# Altium schematic sheet fpga.SchDoc
size A
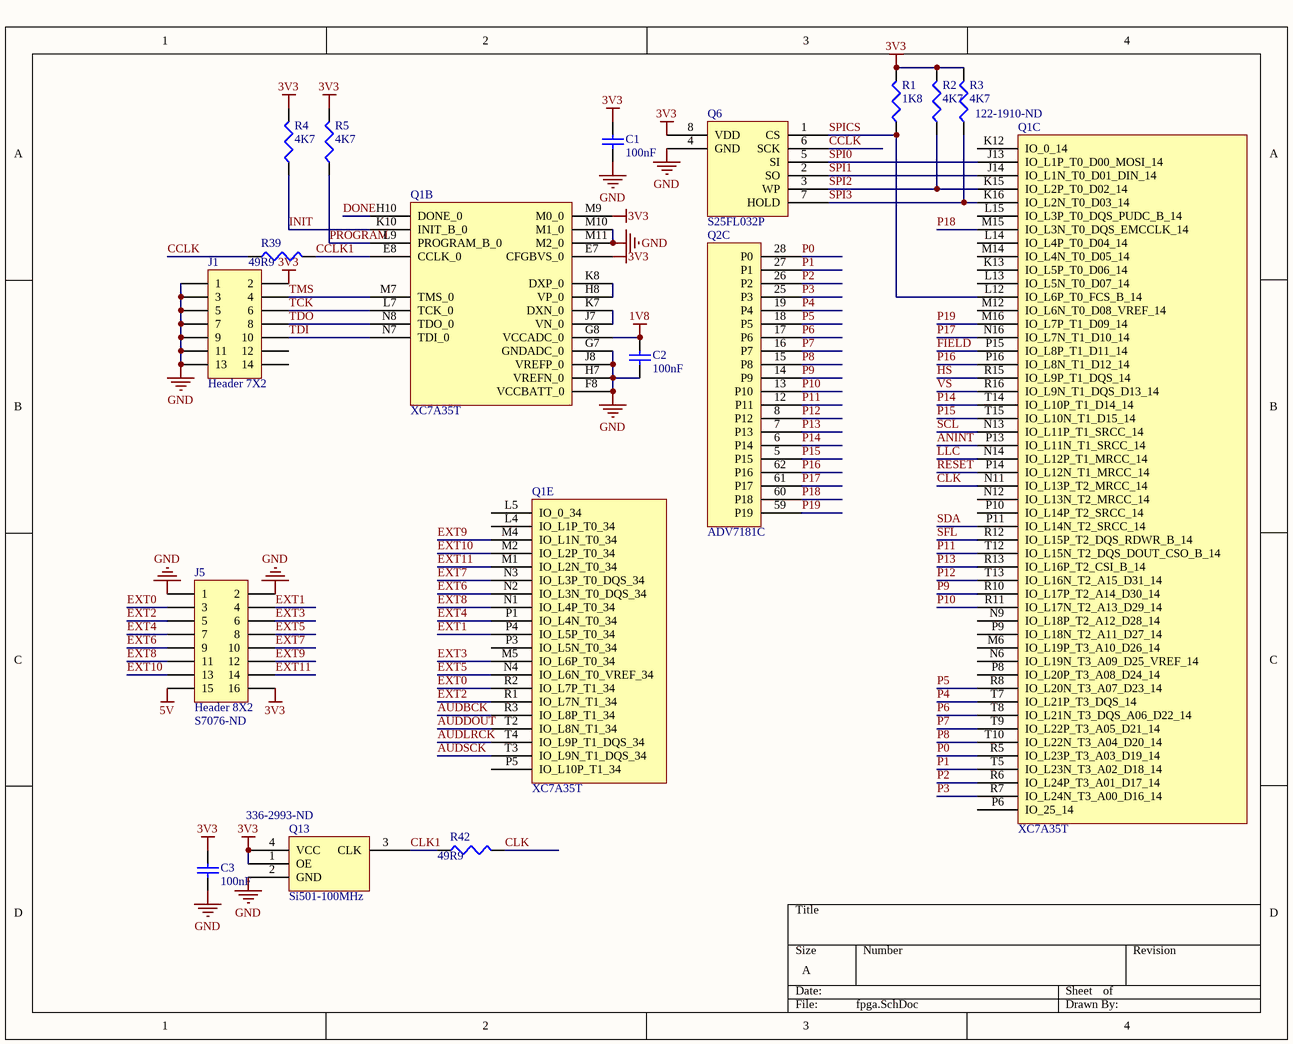
[diagram p0: fpga.SchDoc]

## Parts
C1  value 100nF  [CAPC1005X06L]  (hidden comment: Cap)
C2  value 100nF  [CAPC1005X06L]  (hidden comment: Cap)
C3  value 100nF  [CAPC1005X06L]  (hidden comment: Cap)
J1  Header 7X2  [HDR2X7]
J5  Header 8X2  Supplier Part Number 1: S7076-ND  [HDR2X8]
Q1  XC7A35T  (parts B,C,E of 6)
Q2  ADV7181C  [TSQFP50P1200X1200X145-64N]  (part C of 3)
Q6  S25FL032P  [SOIC127P600X175-8AN]
Q13  Si501-100MHz  Supplier Part Number 1: 336-2993-ND  [Si501_225]
R1  value 1K8  [CAPC1608X90N]  (hidden comment: Res3)
R2  value 4K7  [CAPC1608X90N]  (hidden comment: Res3)
R3  value 4K7  [CAPC1608X90N]  (hidden comment: Res3)
R4  value 4K7  [CAPC1608X90N]  (hidden comment: Res3)
R5  value 4K7  [CAPC1608X90N]  (hidden comment: Res3)
R39  value 49R9  [CAPC1005X06L]  (hidden comment: Res3)
R42  value 49R9  [CAPC1005X06L]  (hidden comment: Res3)

## Nets
1V8: C2.2 Q1.G8(VCCADC_0)
3V3: C1.2 C3.2 J1.2 J5.16 Q1.E7(CFGBVS_0) Q1.M9(M0_0) Q6.8(VDD) Q13.1(OE) Q13.4(VCC) R1.2 R2.2 R3.2 R4.2 R5.2
5V: J5.15
GND: C1.1 C2.1 C3.1 J1.1 J1.3 J1.5 J1.7 J1.9 J1.11 J1.13 J5.1 J5.2 Q1.F8(VCCBATT_0) Q1.G7(GNDADC_0) Q1.H7(VREFN_0) Q1.J8(VREFP_0) Q1.M10(M1_0) Q1.M11(M2_0) Q6.4(GND) Q13.2(GND)
ANINT: Q1.P13(IO_L11N_T1_SRCC_14)
AUDBCK: Q1.R3(IO_L8P_T1_34)
AUDDOUT: Q1.T2(IO_L8N_T1_34)
AUDLRCK: Q1.T4(IO_L9P_T1_DQS_34)
AUDSCK: Q1.T3(IO_L9N_T1_DQS_34)
CCLK: Q6.6(SCK) R39.1
CCLK1: Q1.E8(CCLK_0) R39.2
CLK: Q1.N11(IO_L13P_T2_MRCC_14) R42.2
CLK1: Q13.3(CLK) R42.1
DONE: Q1.H10(DONE_0)
EXT0: J5.3 Q1.R2(IO_L7P_T1_34)
EXT1: J5.4 Q1.P4(IO_L5P_T0_34)
EXT2: J5.5 Q1.R1(IO_L7N_T1_34)
EXT3: J5.6 Q1.M5(IO_L6P_T0_34)
EXT4: J5.7 Q1.P1(IO_L4N_T0_34)
EXT5: J5.8 Q1.N4(IO_L6N_T0_VREF_34)
EXT6: J5.9 Q1.N2(IO_L3N_T0_DQS_34)
EXT7: J5.10 Q1.N3(IO_L3P_T0_DQS_34)
EXT8: J5.11 Q1.N1(IO_L4P_T0_34)
EXT9: J5.12 Q1.M4(IO_L1N_T0_34)
EXT10: J5.13 Q1.M2(IO_L2P_T0_34)
EXT11: J5.14 Q1.M1(IO_L2N_T0_34)
FIELD: Q1.P15(IO_L8P_T1_D11_14)
HS: Q1.R15(IO_L9P_T1_DQS_14)
INIT: Q1.K10(INIT_B_0) R4.1
LLC: Q1.N14(IO_L12P_T1_MRCC_14)
P0: Q1.R5(IO_L23P_T3_A03_D19_14) Q2.28(P0)
P1: Q1.T5(IO_L23N_T3_A02_D18_14) Q2.27(P1)
P2: Q1.R6(IO_L24P_T3_A01_D17_14) Q2.26(P2)
P3: Q1.R7(IO_L24N_T3_A00_D16_14) Q2.25(P3)
P4: Q1.T7(IO_L21P_T3_DQS_14) Q2.19(P4)
P5: Q1.R8(IO_L20N_T3_A07_D23_14) Q2.18(P5)
P6: Q1.T8(IO_L21N_T3_DQS_A06_D22_14) Q2.17(P6)
P7: Q1.T9(IO_L22P_T3_A05_D21_14) Q2.16(P7)
P8: Q1.T10(IO_L22N_T3_A04_D20_14) Q2.15(P8)
P9: Q1.R10(IO_L17P_T2_A14_D30_14) Q2.14(P9)
P10: Q1.R11(IO_L17N_T2_A13_D29_14) Q2.13(P10)
P11: Q1.T12(IO_L15N_T2_DQS_DOUT_CSO_B_14) Q2.12(P11)
P12: Q1.T13(IO_L16N_T2_A15_D31_14) Q2.8(P12)
P13: Q1.R13(IO_L16P_T2_CSI_B_14) Q2.7(P13)
P14: Q1.T14(IO_L10P_T1_D14_14) Q2.6(P14)
P15: Q1.T15(IO_L10N_T1_D15_14) Q2.5(P15)
P16: Q1.P16(IO_L8N_T1_D12_14) Q2.62(P16)
P17: Q1.N16(IO_L7N_T1_D10_14) Q2.61(P17)
P18: Q1.M15(IO_L3N_T0_DQS_EMCCLK_14) Q2.60(P18)
P19: Q1.M16(IO_L7P_T1_D09_14) Q2.59(P19)
PROGRAM: Q1.L9(PROGRAM_B_0) R5.1
RESET: Q1.P14(IO_L12N_T1_MRCC_14)
SCL: Q1.N13(IO_L11P_T1_SRCC_14)
SDA: Q1.P11(IO_L14N_T2_SRCC_14)
SFL: Q1.R12(IO_L15P_T2_DQS_RDWR_B_14)
SPI0: Q1.J13(IO_L1P_T0_D00_MOSI_14) Q6.5(SI)
SPI1: Q1.J14(IO_L1N_T0_D01_DIN_14) Q6.2(SO)
SPI2: Q1.K15(IO_L2P_T0_D02_14) Q6.3(WP) R2.1
SPI3: Q1.K16(IO_L2N_T0_D03_14) Q6.7(HOLD) R3.1
SPICS: Q1.L12(IO_L6P_T0_FCS_B_14) Q6.1(CS) R1.1
TCK: J1.6 Q1.L7(TCK_0)
TDI: J1.10 Q1.N7(TDI_0)
TDO: J1.8 Q1.N8(TDO_0)
TMS: J1.4 Q1.M7(TMS_0)
VS: Q1.R16(IO_L9N_T1_DQS_D13_14)
NetQ1_H8: Q1.H8(VP_0) Q1.K8(DXP_0)
NetQ1_J7: Q1.J7(VN_0) Q1.K7(DXN_0)

Not connected (* = marked no-connect by the designer): J1 12 14; Q1 K12(IO_0_14) K13(IO_L5P_T0_D06_14) L4(IO_L1P_T0_34) L5(IO_0_34) L13(IO_L5N_T0_D07_14) L14(IO_L4P_T0_D04_14) L15(IO_L3P_T0_DQS_PUDC_B_14) M6(IO_L19P_T3_A10_D26_14) M12(IO_L6N_T0_D08_VREF_14) M14(IO_L4N_T0_D05_14) N6(IO_L19N_T3_A09_D25_VREF_14) N9(IO_L18P_T2_A12_D28_14) N12(IO_L13N_T2_MRCC_14) P3(IO_L5N_T0_34) P5(IO_L10P_T1_34) P6(IO_25_14) P8(IO_L20P_T3_A08_D24_14) P9(IO_L18N_T2_A11_D27_14) P10(IO_L14P_T2_SRCC_14)

## Library data of the parts
C1-C3 = Cap: Capacitor; Published: 8-Jun-2000; LatestRevisionDate: 17-Jul-2002; LatestRevisionNote: Re-released for DXP Platform.; PackageReference: RAD-0.3; Publisher: Altium Limited; PackageDescription: Radial Cap, Thru-Hole; 2 Leads; 0.3 in Pin Spacing
J1 = Header 7X2: Header, 7-Pin, Dual row; LatestRevisionDate: 17-Jul-2002; LatestRevisionNote: Re-released for DXP Platform.; Publisher: Altium Limited
J5 = Header 8X2: Header, 8-Pin, Dual row; LatestRevisionDate: 17-Jul-2002; LatestRevisionNote: Re-released for DXP Platform.; Publisher: Altium Limited; Supplier 1: Digi-Key
Q13 = Si501: Supplier 1: Digi-Key
R1-R5 R39 R42 = Res3: Resistor; Published: 8-Jun-2000; LatestRevisionDate: 29-May-2009; LatestRevisionNote: IPC-7351 Footprint Added.; PackageReference: J1-0603; Publisher: Altium Limited; PackageDescription: Chip Resistor; Supplier 1: Digi-Key
  R1: Supplier Part Number 1: 1276-5068-1-ND
  R2-R5: Supplier Part Number 1: 1276-5078-1-ND
  R39 R42: Supplier Part Number 1: 1276-3505-1-ND
Q6 = S25FL032P: Supplier 1: Digi-Key; Supplier Part Number 1: S25FL032P0XMFI011-ND